# EAGLE schematic Test Board (EAGLE 6.5.0)
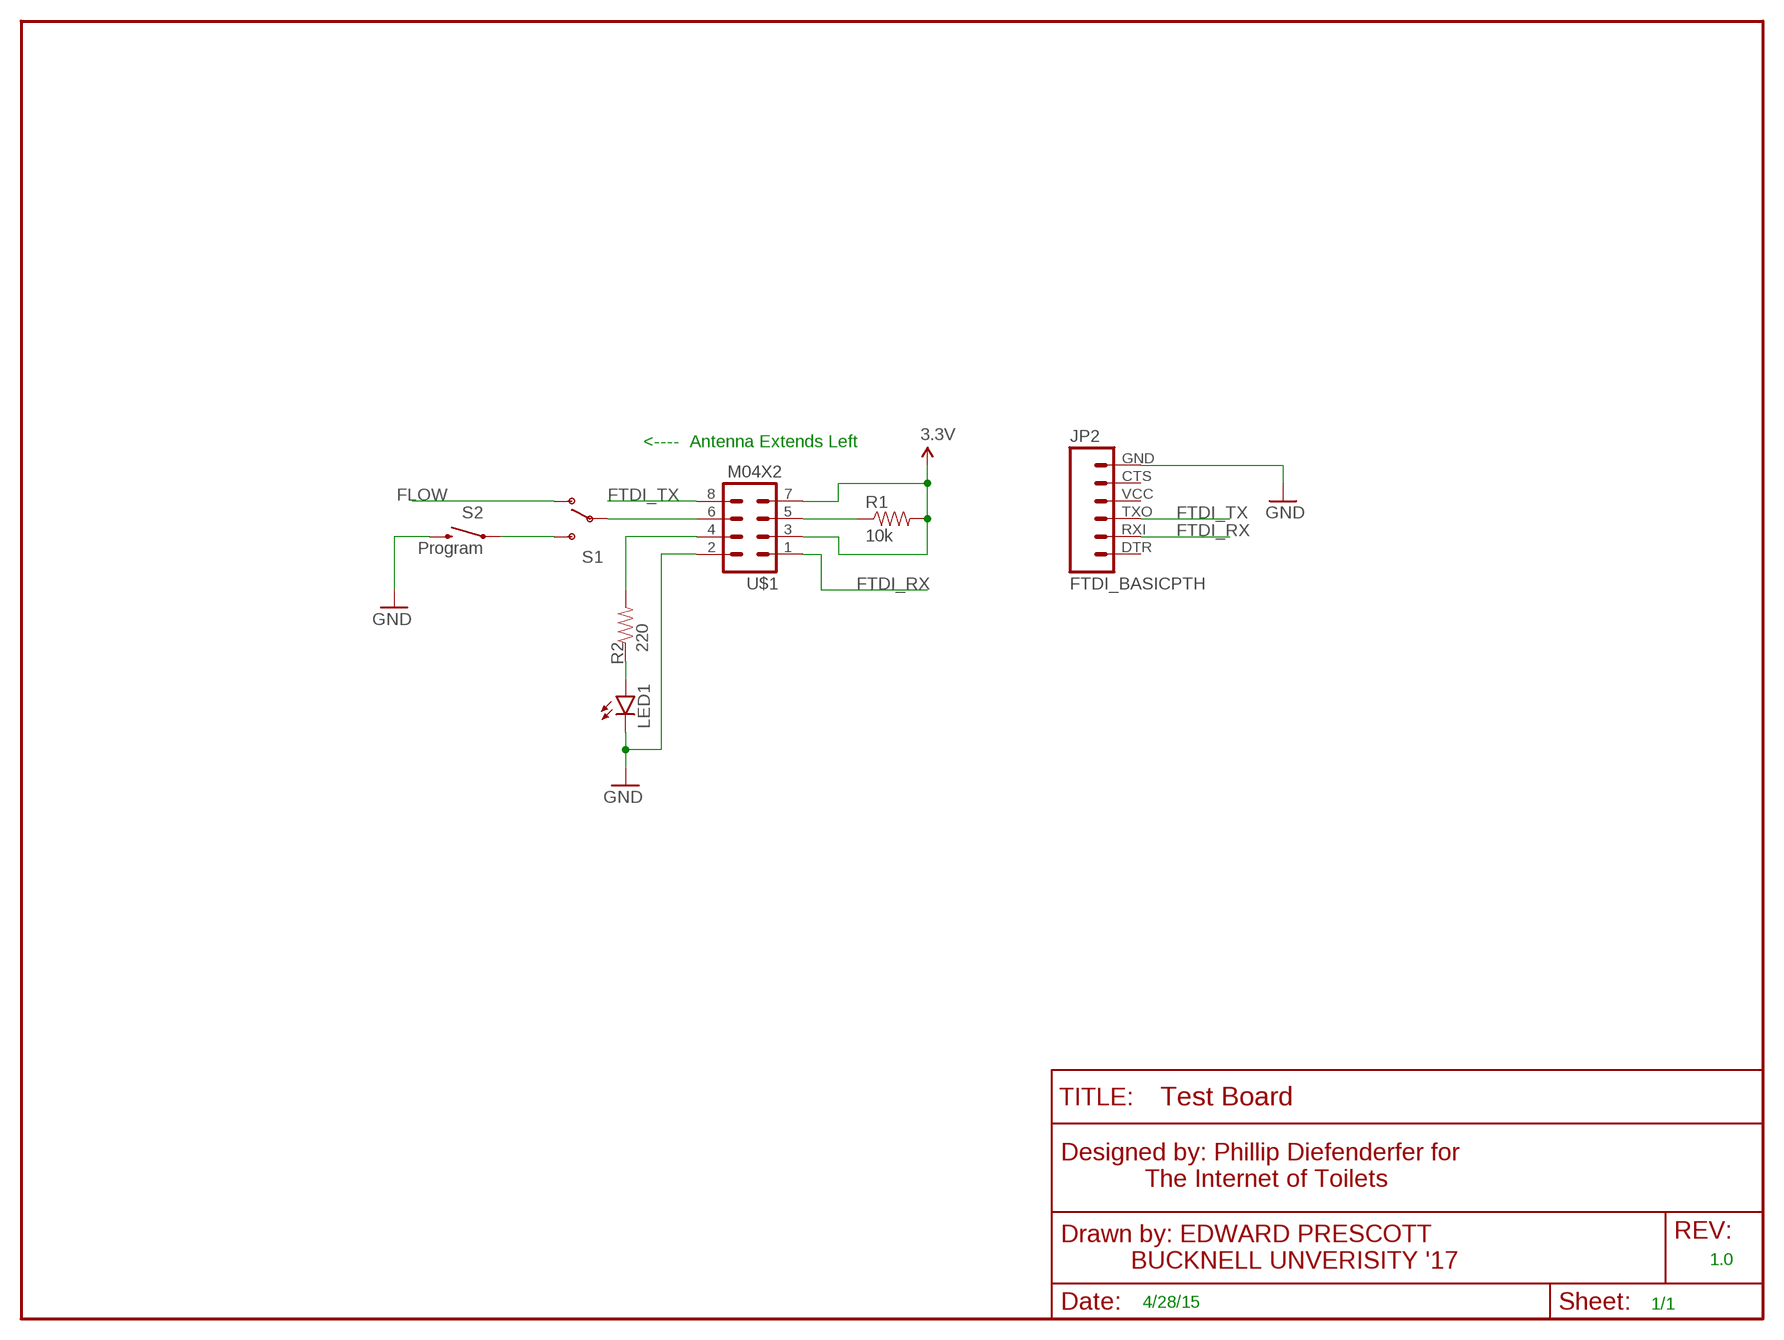
[diagram p0: schematic, sheet 1]

## Parts
FRAME1  FRAME-LETTER  [CREATIVE_COMMONS]
JP2  FTDI_BASICPTH  [FTDI_BASIC]
LED1  LED-3MM-NO_SILK  [LED3MM-NS]
R1  10k  RESISTORAXIAL-0.3  [AXIAL-0.3]
R2  220  RESISTORAXIAL-0.3  [AXIAL-0.3]
S1  SWITCH-SPDTPTH  [SWITCH-SPDT]
S2  Program  SWITCH-MOMENTARY-2PTH  [TACTILE-PTH]
U$1  M04X2  [2X4]

## Nets
3.3V: R1.P$2 U$1.3 U$1.7
FLOW: S1.1(O)
FTDI_RX: JP2.RXI U$1.1
FTDI_TX: JP2.TXO U$1.8
GND: JP2.GND LED1.K(C) S2.3 U$1.2
N$1: S1.3(S) S2.1
N$2: R1.P$1 U$1.5
N$3: R2.P$2 U$1.4
N$4: S1.2(P) U$1.6
N$5: LED1.A R2.P$1
Unconnected: JP2.CTS JP2.DTR JP2.VCC

## Notes on the sheet
- <----  Antenna Extends Left
- 1.0
- 4/28/15 | 1/1

## Library data of the parts
FRAME1 = SparkFun-Aesthetics:FRAME-LETTER: Schematic Frame Standard 8.5x11 US Letter frame
JP2 = SparkFun-Connectors:FTDI_BASIC: FTDI Basic header with labels
LED1 = SparkFun-LED:LED: LEDs Standard schematic elements and footprints for 5mm, 3mm, 1206, and 0603 sized LEDs. 5mm - Spark Fun Electronics SKU : COM-00529 (and others)
R1 R2 = SparkFun-Resistors:RESISTOR: Resistor Basic schematic elements and footprints for 0603, 1206, and PTH resistors.
S1 = SparkFun-Electromechanical:SWITCH-SPDT: SPDT Switch Simple slide switch, Spark Fun Electronics SKU : COM-00102 DPDT SMT slide switch, AYZ0202, SWCH-08179
S2 = SparkFun-Electromechanical:SWITCH-MOMENTARY-2: Various NO switches- pushbuttons, reed, etc
U$1 = SparkFun-Connectors:M04X2: .1" header, two rows of four.